# Altium schematic sheet Table.SchDoc
size A4
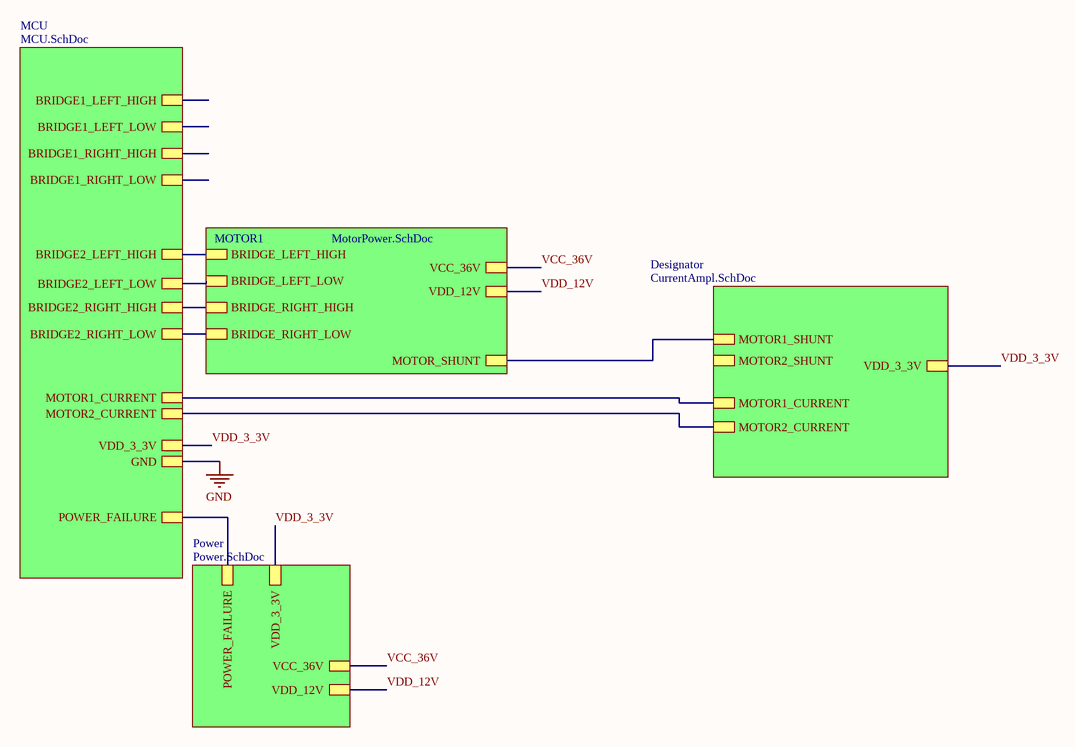
[diagram p0: Table.SchDoc]

## Sub-sheets
Designator = CurrentAmpl.SchDoc: MOTOR1_SHUNT, MOTOR2_SHUNT, MOTOR2_CURRENT, MOTOR1_CURRENT, VDD_3_3V
MCU = MCU.SchDoc: BRIDGE1_LEFT_LOW, BRIDGE1_RIGHT_HIGH, BRIDGE1_RIGHT_LOW, BRIDGE1_LEFT_HIGH, BRIDGE2_LEFT_HIGH, BRIDGE2_RIGHT_HIGH, BRIDGE2_LEFT_LOW, BRIDGE2_RIGHT_LOW, VDD_3_3V, GND, POWER_FAILURE, MOTOR1_CURRENT, MOTOR2_CURRENT
MOTOR1 = MotorPower.SchDoc: MOTOR_SHUNT, VCC_36V, BRIDGE_LEFT_HIGH, VDD_12V, BRIDGE_LEFT_LOW, BRIDGE_RIGHT_HIGH, BRIDGE_RIGHT_LOW
Power = Power.SchDoc: POWER_FAILURE, VDD_12V, VDD_3_3V, VCC_36V

## Nets
GND: sheet MCU/GND
VCC_36V: sheet MOTOR1/VCC_36V, sheet Power/VCC_36V
VDD_3_3V: sheet MCU/VDD_3_3V, sheet Designator/VDD_3_3V, sheet Power/VDD_3_3V
VDD_12V: sheet MOTOR1/VDD_12V, sheet Power/VDD_12V
(unnamed): sheet MCU/BRIDGE2_LEFT_HIGH, sheet MOTOR1/BRIDGE_LEFT_HIGH
(unnamed): sheet MCU/BRIDGE2_RIGHT_HIGH, sheet MOTOR1/BRIDGE_RIGHT_HIGH
(unnamed): sheet MCU/BRIDGE2_LEFT_LOW, sheet MOTOR1/BRIDGE_LEFT_LOW
(unnamed): sheet MCU/BRIDGE2_RIGHT_LOW, sheet MOTOR1/BRIDGE_RIGHT_LOW
(unnamed): sheet MCU/POWER_FAILURE, sheet Power/POWER_FAILURE
(unnamed): sheet MCU/MOTOR1_CURRENT, sheet Designator/MOTOR1_CURRENT
(unnamed): sheet MCU/MOTOR2_CURRENT, sheet Designator/MOTOR2_CURRENT
(unnamed): sheet MOTOR1/MOTOR_SHUNT, sheet Designator/MOTOR1_SHUNT